# Altium schematic sheet Mixed-mode Binary Ripple 555.schdoc: Mixed Mode 555 / Binary Counter
size A4; Organization: Altium Limited; Address1: L3, 12a Rodborough Rd; Address2: Frenchs Forest; Address3: NSW; Address4: Australia 2086; DocumentNumber: 1; SheetNumber: 1; SheetTotal: 1
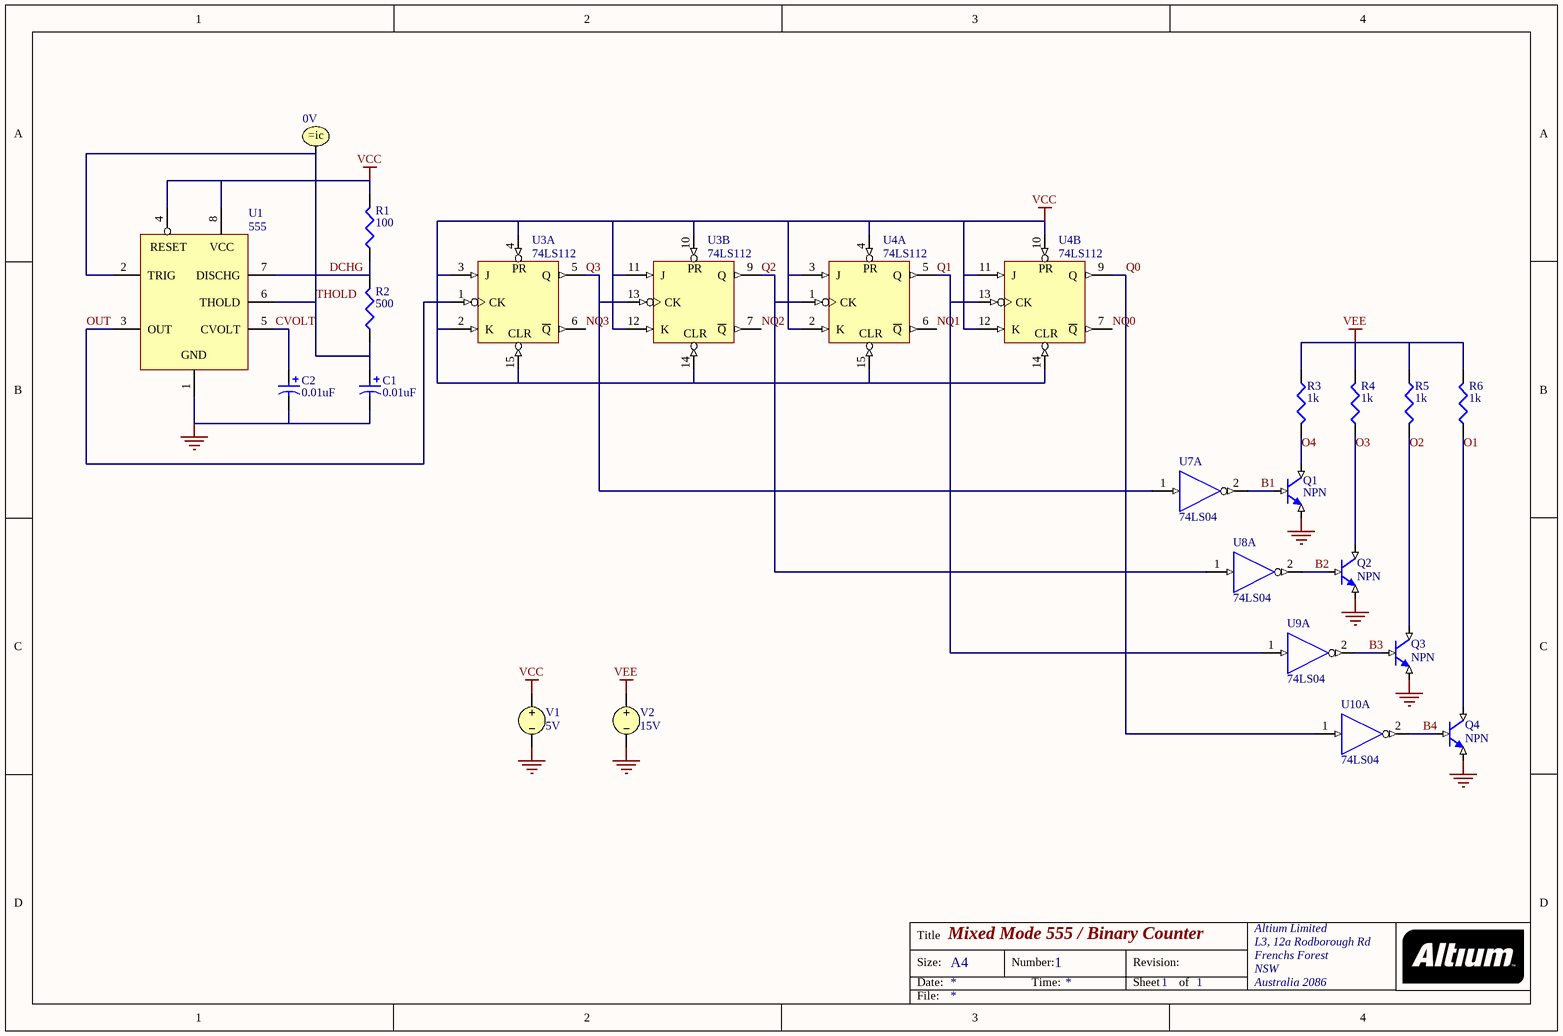
[diagram p0: Mixed-mode Binary Ripple 555.schdoc]

## Parts
C1  0.01uF
C2  0.01uF
IC1  0V
Q1  NPN
Q2  NPN
Q3  NPN
Q4  NPN
R1  100
R2  500
R3  1k
R4  1k
R5  1k
R6  1k
U1  555
U3  74LS112  (parts A,B of 2)
U4  74LS112  (parts A,B of 2)
U7  74LS04  (part A of 6)
U8  74LS04  (part A of 6)
U9  74LS04  (part A of 6)
U10  74LS04  (part A of 6)
V1  5V
V2  15V

## Nets
GND: C1.2 C2.2 Q1.3(E) Q2.3(E) Q3.3(E) Q4.3(E) U1.1(GND) U3.8(GND) U4.8(GND) U7.7(GND) U8.7(GND) U9.7(GND) U10.7(GND) V1.2 V2.2
VCC: R1.1(TOP) U1.4(RESET) U1.8(VCC) U3.2(K) U3.3(J) U3.4(PR) U3.10(PR) U3.11(J) U3.12(K) U3.14(CLR) U3.15(CLR) U3.16(VCC) U4.2(K) U4.3(J) U4.4(PR) U4.10(PR) U4.11(J) U4.12(K) U4.14(CLR) U4.15(CLR) U4.16(VCC) U7.14(VCC) U8.14(VCC) U9.14(VCC) U10.14(VCC) V1.1
VEE: R3.2(BOT) R4.1(TOP) R5.2(BOT) R6.1(TOP) V2.1
B1: Q1.2(B) U7.2(Y)
B2: Q2.2(B) U8.2(Y)
B3: Q3.2(B) U9.2(Y)
B4: Q4.2(B) U10.2(Y)
CVOLT: C2.1 U1.5(CVOLT)
DCHG: R1.2(BOT) R2.1(TOP) U1.7(DISCHG)
NQ0: U4.7(~{Q})
NQ1: U4.6(~{Q})
NQ2: U3.7(~{Q})
NQ3: U3.6(~{Q})
O1: Q4.1(C) R6.2(BOT)
O2: Q3.1(C) R5.1(TOP)
O3: Q2.1(C) R4.2(BOT)
O4: Q1.1(C) R3.1(TOP)
OUT: U1.3(OUT) U3.1(CK)
Q0: U4.9(Q) U10.1(A)
Q1: U4.5(Q) U4.13(CK) U9.1(A)
Q2: U3.9(Q) U4.1(CK) U8.1(A)
Q3: U3.5(Q) U3.13(CK) U7.1(A)
THOLD: C1.1 IC1.1 R2.2(BOT) U1.2(TRIG) U1.6(THOLD)

## Notes on the sheet
- Title
- Size:
- Date:
- A4
- Number:
- Time:
- Revision:
- Sheet
- of
- File:

## Library data of the parts
C1 C2 = CAP2: Bi-Polar Capacitor; Value: 0.01uF
IC1 = .IC: Initial Condition; Initial Voltage: 0V
Q1-Q4 = NPN: NPN BJT
R1-R6 = RES: Resistor
  R1: Value: 100
  R2: Value: 500
  R3-R6: Value: 1k
U1 = 555: Timer
U3 U4 = 74LS112: Dual J-K Negative-Edge-Triggered Flip-Flop with Clear and Preset
U7-U10 = 74LS04: Hex Inverter
V1 V2 = VSRC: Voltage Source
  V1: Value: 5V
  V2: Value: 15V